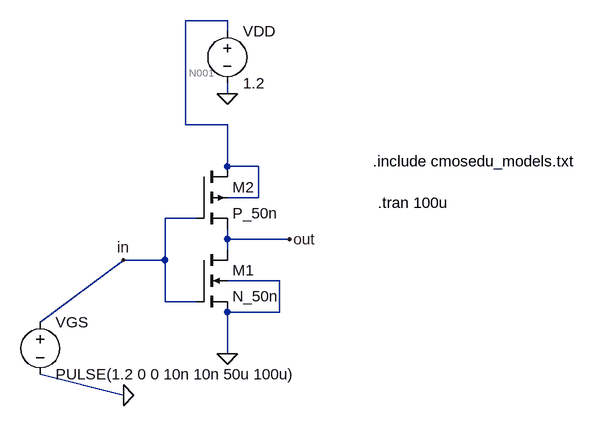
[diagram p0: schematic inversor.asc]
inversor.asc, the LTspice schematic file:
Version 4
SHEET 1 880 680
WIRE 176 -160 112 -160
WIRE 176 -144 176 -160
WIRE 176 -48 176 -64
WIRE 112 0 112 -160
WIRE 176 0 112 0
WIRE 176 64 176 0
WIRE 224 64 176 64
WIRE 224 112 224 64
WIRE 224 112 176 112
WIRE 128 144 80 144
WIRE 176 176 176 160
WIRE 272 176 176 176
WIRE 176 192 176 176
WIRE 80 208 80 144
WIRE 80 208 16 208
WIRE 256 240 176 240
WIRE 80 272 80 208
WIRE 128 272 80 272
WIRE 256 288 256 240
WIRE 256 288 176 288
WIRE -112 304 16 208
WIRE 176 352 176 288
WIRE 16 416 -112 384
FLAG 176 352 0
FLAG 16 416 0
FLAG 176 -48 0
FLAG 16 208 in
FLAG 272 176 out
SYMBOL voltage -112 288 R0
WINDOW 123 0 0 Left 2
WINDOW 39 0 0 Left 2
SYMATTR InstName VGS
SYMATTR Value PULSE(1.2 0 0 10n 10n 50u 100u)
SYMBOL nmos4 128 192 R0
SYMATTR InstName M1
SYMATTR Value N_50n
SYMATTR Value2 l=50n w=0.5u
SYMBOL pmos4 128 64 R0
SYMATTR InstName M2
SYMATTR Value P_50n
SYMATTR Value2 l=50n w=0.5u
SYMBOL voltage 176 -160 R0
WINDOW 123 0 0 Left 2
WINDOW 39 0 0 Left 2
SYMATTR InstName VDD
SYMATTR Value 1.2
TEXT 408 120 Left 2 !.tran 100u
TEXT 400 56 Left 2 !.include cmosedu_models.txt

The netlist it stands for:
* inversor.asc
VGS in 0 PULSE(1.2 0 0 10n 10n 50u 100u)
M1 out in 0 0 N_50n l=50n w=0.5u
M2 N001 in out N001 P_50n l=50n w=0.5u
VDD N001 0 1.2
.model NMOS NMOS
.model PMOS PMOS
.lib standard.mos
.tran 100u
.include cmosedu_models.txt
.backanno
.end

* Results of the author's LTspice run, read from the files saved beside the schematic
* Operating Point, zero values left out:
*   V(in) = 1.2 V
*   V(out) = 18.72 µV
*   V(n001) = 1.2 V
*   Id(M2) = 4.632 nA
*   Ig(M2) = 11.65 nA
*   Ib(M2) = 3.8 pA
*   Is(M2) = -16.29 nA
*   Id(M1) = 16.29 nA
*   Ig(M1) = 5.149 nA
*   Ib(M1) = -714.3 pA
*   Is(M1) = -20.72 nA
*   I(Vdd) = -4.636 nA
*   I(Vgs) = -16.8 nA
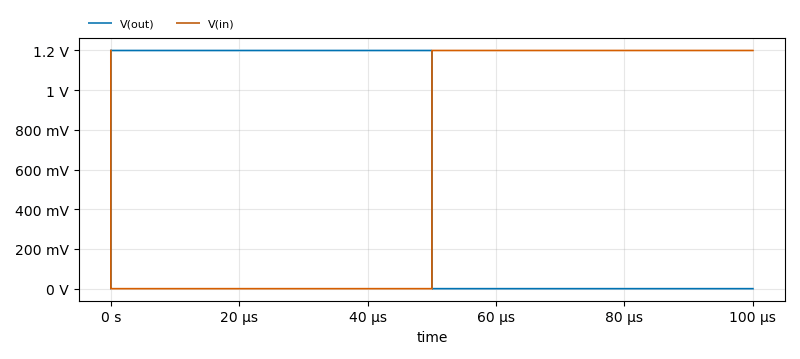
[diagram p1: Transient Analysis of inversor.asc, plotted from the saved traces]
* Transient Analysis, 1 run:
*   V(out): min -643.6 µV, max 1.201 V, average 600.1 mV, rms 848.6 mV, last 18.71 µV
*   V(in): min 0 V, max 1.2 V, average 599.9 mV, rms 848.4 mV, last 1.2 V